# EAGLE design whey-pendant-revA (EAGLE 9.4.0)
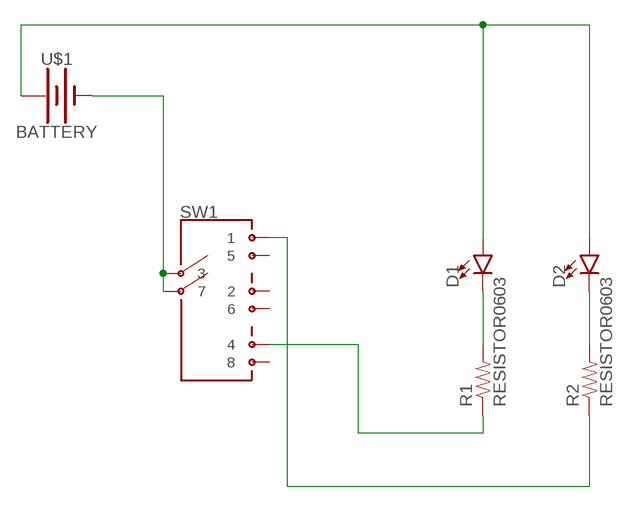
[diagram p0: schematic, sheet 1]

## Parts
D1  LED1206  [LED-1206]
D2  LED1206  [LED-1206]
R1  RESISTOR0603  [R0603]
R2  RESISTOR0603  [R0603]
SW1  JS203011JCQN  [JS203011JCQN]
U$1  BATTERY  [COINCELL16]

## Nets
N$1: D1.A D2.A U$1.P$1(+) U$1.P$2(+)
N$2: D1.C R1.2
N$3: D2.C R2.2
N$4: SW1.3 SW1.7 U$1.P$3(-)
N$5: R1.1 SW1.4
N$6: R2.1 SW1.1
Unconnected: SW1.2 SW1.5 SW1.6 SW1.8

## Library data of the parts
D1 D2 = SparkFun-LED:LED: LED (Generic) Standard schematic elements and footprints for 5mm, 3mm, 1206, and 0603 sized LEDs. Generic LEDs with no color specified.
R1 R2 = BeagleBone_Blue_R3:RESISTOR
SW1 = shlomo:JS203011JCQN
U$1 = shlomo:BATTERY

## Board
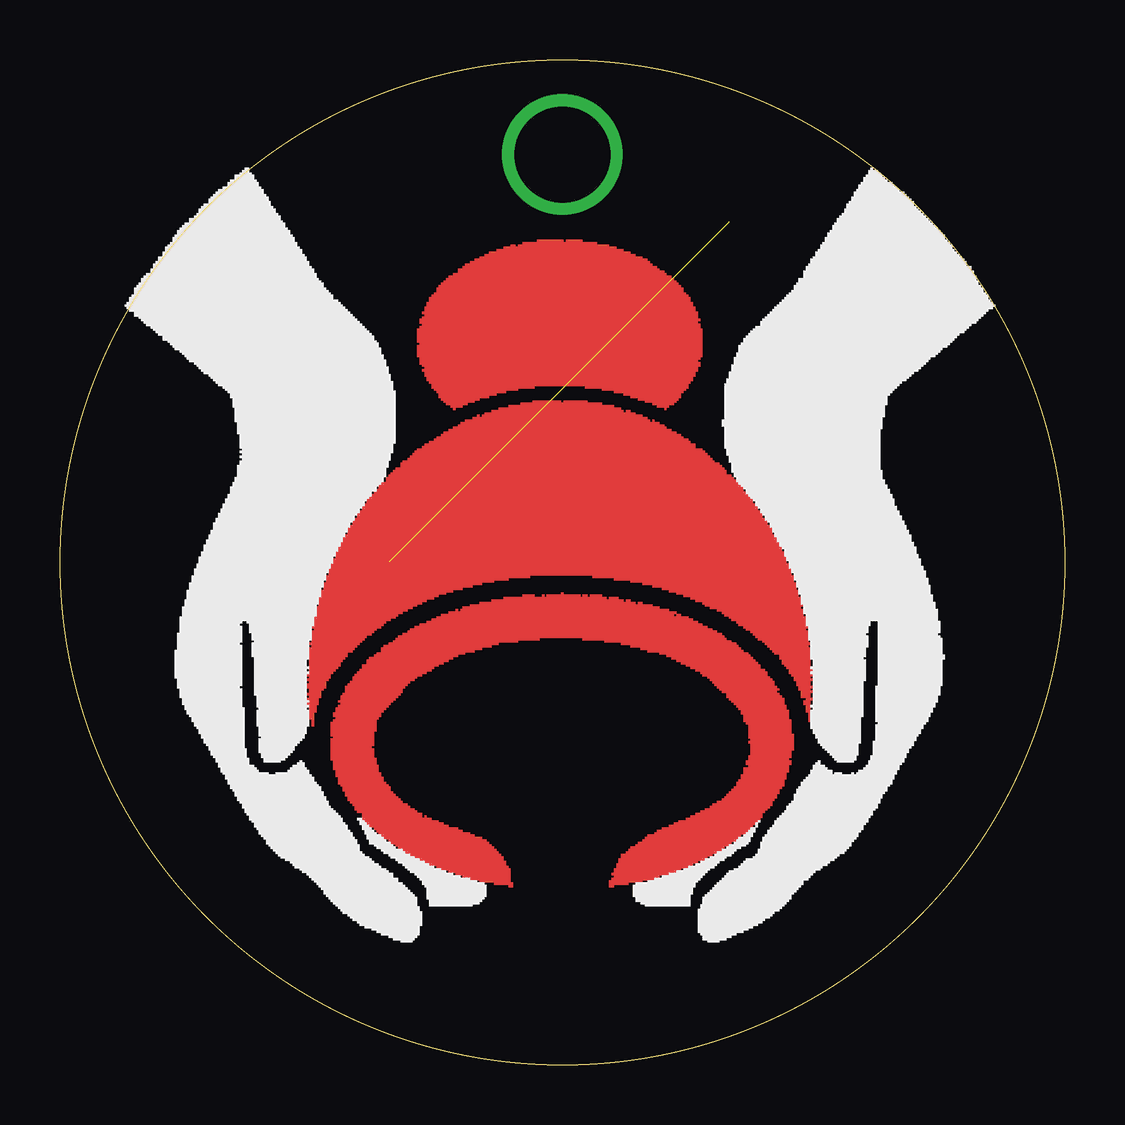
[diagram p1: board, top side]
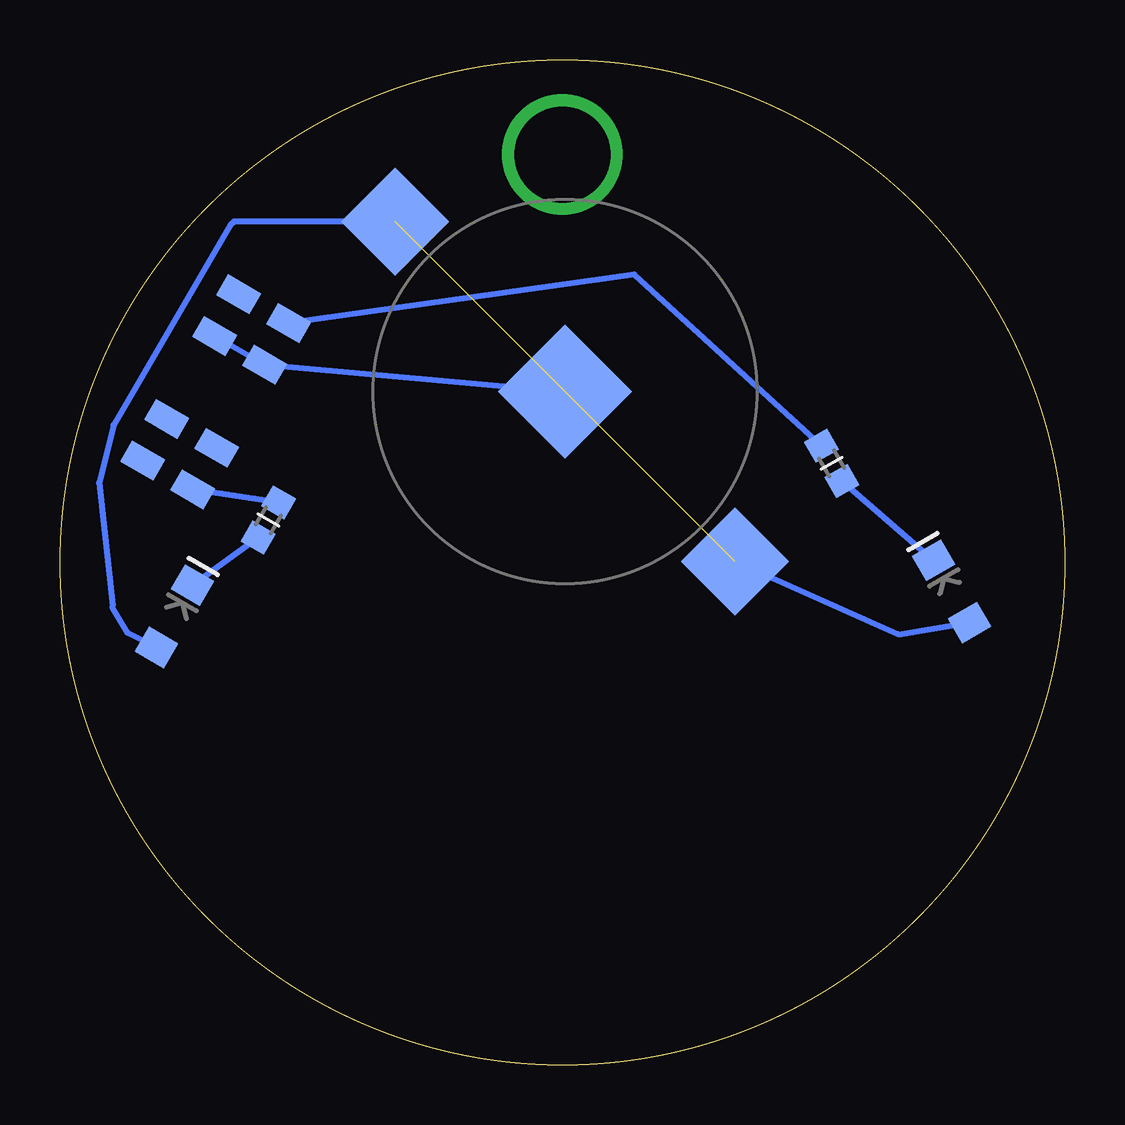
[diagram p2: board, bottom side, seen from below]

Size 41.88 x 41.88 mm. Coordinates in mm from the lower left corner, seen from the top.
Outline: circle at 20.94,20.94 radius 20.94
Copper layers (1*16): Top 0.035mm / dielectric 1.5mm / Bottom 0.035mm
Design rules "default": minimum track width 6mil, minimum drill 0.35mm, track to track 6mil, track to pad 6mil, pad to pad 6mil, via to via 6mil, smd to smd 6mil, copper to edge 40mil, drill to drill 6mil, minimum pad ring 10mil, minimum via ring 8mil, stop-mask expansion 4mil, vias tented up to drill 0mil, thermal gap 10mil

### Footprints (pad centres in the part's own frame; a part is rotated, then mirrored left to right if it is on the bottom)
LED-1206 = smd 1.2 x 1.4: A -1.5,0; C 1.5,0
R0603 = smd 1 x 1.1: 1 -0.85,0; 2 0.85,0
JS203011JCQN = smd 1 x 1.6: 1 -4,-1.2; 2 -2,-1.2; 3 2,-1.2; 4 4,-1.2; 5 -4,1.2; 6 -2,1.2; 7 2,1.2; 8 4,1.2
COINCELL16 = smd 3.18 x 3.18: P$1 -10.02,0; P$2 10.02,0 | smd 3.96 x 3.96: P$3 0,0

### Placement (x,y rotation side)
D1  4.72,19.73 120 bottom
D2  37.1,18.69 60 bottom
R1  9.71,25.06 300 bottom
R2  33.2,22.7 240 bottom
SW1  35.39,28.05 60 bottom
U$1  20.83,28.06 315 bottom

### Tracks (layer width: path | path; a pad name or v marks a point on that pad's centre or on a via)
N$1  (1 unrouted)
  Bottom 0.254: U$1.P$2 6.94,17.94 D1.A | U$1.P$1 34.63,35.14 34.78,34.99 39.64,26.66 40.25,24.25 39.69,19.12 39.69,19.04 39.06,18 D2.A
N$2
  Bottom 0.254: D1.C R1.2
N$3
  Bottom 0.254: D2.C R2.2
N$4
  Bottom 0.254: SW1.7 SW1.3 U$1.P$3
N$5
  Bottom 0.254: R1.1 17.94,32.94 SW1.4
N$6
  Bottom 0.254: R2.1 SW1.1
N$7  (via drill 4)
  other vias: 20.94,37.94
(copper drawn outside any net)
  shapes: Top area x521

### Text on the board
215bmp: /Users/shlomo/Downloads/whey-var2 (2).bmp